# Altium schematic sheet IO_Combo_Keyboard_Mouse.SchDoc: Keyboard Mouse
size Tabloid; Date: 09/20/2024; Engineer: Terry D. Schevker; Revision: 1.0; SheetNumber: 1; SheetTotal: 5
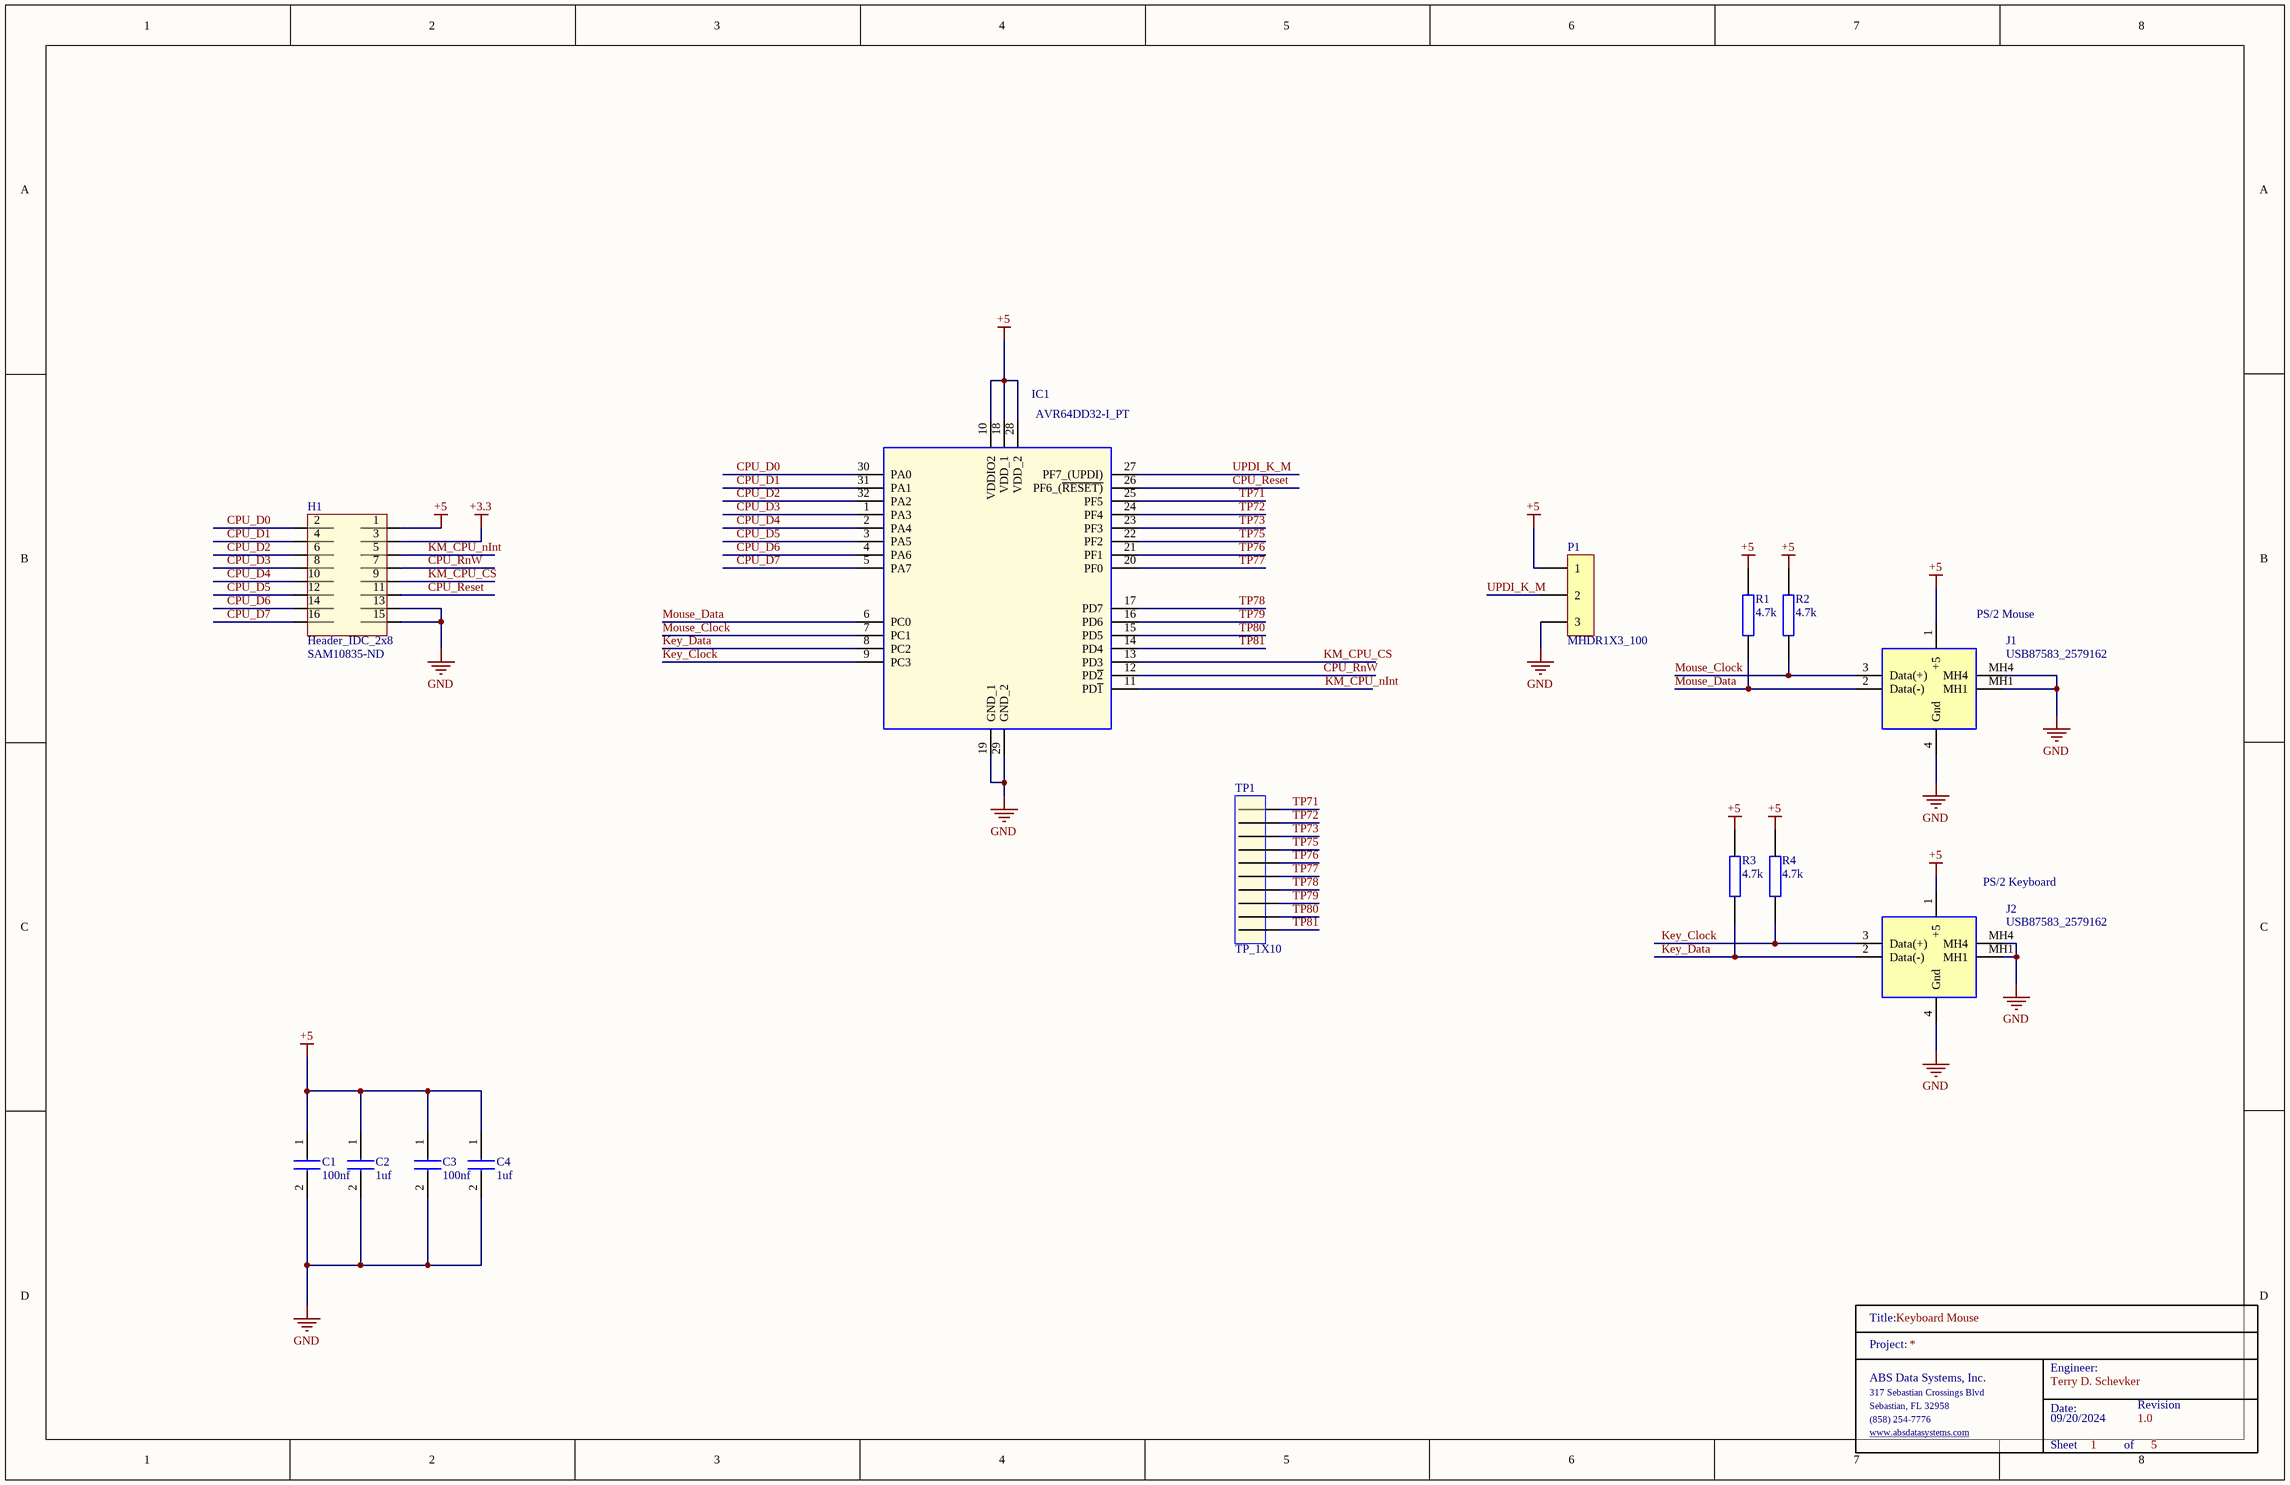
[diagram p0: IO_Combo_Keyboard_Mouse.SchDoc]

## Parts
C1  100nf  [0603]
C2  1uf  [0603]
C3  100nf  [0603]
C4  1uf  [0603]
H1  Header_IDC_2x8  Supplier Part Number 1: SAM10835-ND  [HEADER16]
IC1  AVR64DD32-I_PT  [QFP80P900X900X120-32N]
J1  USB87583_2579162  [87583-2579162]
J2  USB87583_2579162  [87583-2579162]
P1  MHDR1X3_100  [MHDR1X3_100]
R1  4.7k  [0603]
R2  4.7k  [0603]
R3  4.7k  [0603]
R4  4.7k  [0603]
TitleBlock_1  TitleBlock  (value not drawn)  (graphical)
TP1  TP_1X10  [TP_1X10]

## Nets
+3.3: H1.3
+5: C1.1 C2.1 C3.1 C4.1 H1.1 IC1.10(VDDIO2) IC1.18(VDD_1) IC1.28(VDD_2) J1.1(+5) J2.1(+5) P1.1 R1.1 R2.1 R3.1 R4.1
GND: C1.2 C2.2 C3.2 C4.2 H1.13 H1.15 IC1.19(GND_1) IC1.29(GND_2) J1.4(Gnd) J1.MH1 J1.MH4 J2.4(Gnd) J2.MH1 J2.MH4 P1.3
CPU_D0: H1.2 IC1.30(PA0)
CPU_D1: H1.4 IC1.31(PA1)
CPU_D2: H1.6 IC1.32(PA2)
CPU_D3: H1.8 IC1.1(PA3)
CPU_D4: H1.10 IC1.2(PA4)
CPU_D5: H1.12 IC1.3(PA5)
CPU_D6: H1.14 IC1.4(PA6)
CPU_D7: H1.16 IC1.5(PA7)
CPU_Reset: H1.11 IC1.26(PF6_(~{RESET)})
CPU_RnW: H1.7 IC1.12(PD~{2})
Key_Clock: IC1.9(PC3) J2.3(Data(+)) R4.2
Key_Data: IC1.8(PC2) J2.2(Data(-)) R3.2
KM_CPU_CS: H1.9 IC1.13(PD3)
KM_CPU_nInt: H1.5 IC1.11(PD~{1})
Mouse_Clock: IC1.7(PC1) J1.3(Data(+)) R2.2
Mouse_Data: IC1.6(PC0) J1.2(Data(-)) R1.2
TP71: IC1.25(PF5) TP1.1
TP72: IC1.24(PF4) TP1.2
TP73: IC1.23(PF3) TP1.3
TP75: IC1.22(PF2) TP1.4
TP76: IC1.21(PF1) TP1.5
TP77: IC1.20(PF0) TP1.6
TP78: IC1.17(PD7) TP1.7
TP79: IC1.16(PD6) TP1.8
TP80: IC1.15(PD5) TP1.9
TP81: IC1.14(PD4) TP1.10
UPDI_K_M: IC1.27(PF7_(UPDI)) P1.2

## Notes on the sheet
- (near J1) PS/2 Mouse
- (near J2) PS/2 Keyboard
- (in symbol TitleBlock) Title:; Project:; Engineer:; ABS Data Systems, Inc.; 317 Sebastian Crossings Blvd; Sebastian, FL 32958; Date:; Revision; (858) 254-7776; www.absdatasystems.com; Sheet; of

## Library data of the parts
C1 C3 = CL10B104JB8NNNC: Samsung Electro-Mechanics 0603 100nf
C2 C4 = CL10B105KA8NNNL: Samsung Electro-Mechanics 0603 1uf
H1 = Header_IDC_2x8: 16 Pin 2x8 Through Hold IDC Connector; Manufacturer: Samtec; Manufacturer Part Number: TST-108-01-G-D; Number of Contacts: 16; Gender: Male; Connector Type: Male Pin; Pitch: 2.54mm; Row Spacing: 0.1inch; Supplier 1: Digi-Key; RoHS: Yes; Category: Headers and Wire Housings; Stock 1: 227; Pricing 1: 1=2.85000, 10=2.73600, 100=2.28000, 500=1.93800, 1000=1.65300, 5000=1.48200 (USD); Mount: Through Hole; Contact Plating: Gold; Contact Material: Bronze; Housing Material: Polyester; Housing Color: Black; Color: Black; Min Operating Temperature: -55°C; Max Operating Temperature: 125°C; Number of Rows: 2; Termination: Solder; Packaging: Rail/Tube; Orientation: Straight; Number of Positions: 16; Length: 27.94mm; Depth: 9.27mm; Contact Mating Length: 0.25inch; REACH SVHC: No SVHC; ComponentLink1URL: https://datasheet.ciiva.com/739/tst-mkt-739845.pdf?src-supplier=Digi-Key; ComponentLink1Description: https://datasheet.ciiva.com/739/tst-mkt-739845.pdf?src-supplier=Digi-Key; ComponentLink2URL: https://datasheet.ciiva.com/10018/htst-10018510.pdf?src-supplier=Avnet; ComponentLink2Description: https://datasheet.ciiva.com/10018/htst-10018510.pdf?src-supplier=Avnet
IC1 = AVR64DD32-I_PT: Integrated Circuit; Manufacturer_Name: Microchip; Manufacturer_Part_Number: AVR64DD32-I/PT | MULTI-VOLTAGE I/O; Datasheet Link: https://www.microchip.com/en-us/product/AVR64DD32; Height: 1.2mm
J1 J2 = USB87583_2579162: USB Connectors USB A Plug, SMT, R/A, GF, With Kinked shell stakes and posts, T&R; Manufacturer_Name: GCT (GLOBAL CONNECTOR TECHNOLOGY); Manufacturer_Part_Number: USB1061-GF-L-A; Geometry.Height: 4.6mm; Mouser Part Number: 640-USB1061-GF-L-A; Mouser Price/Stock: https://www.mouser.co.uk/ProductDetail/GCT/USB1061-GF-L-A?qs=KUoIvG%2F9IlYSthVIrIBVzQ%3D%3D; Datasheet Link: https://gct.co/connector/usb1061
P1 = MHDR1X3_100: Header, 3-Pin; LatestRevisionDate: 17-Jul-2002; LatestRevisionNote: Re-released for DXP Platform.; Publisher: Altium Limited
R1-R4 = RC0603FR-104K7L: YAGEO 0603 4.7k; Manufacturer_Name: KEMET; Manufacturer_Part_Number: RC0603JR-070RL; Geometry.Height: 0.55mm; Mouser Part Number: 603-RC0603JR-070RL; Mouser Price/Stock: https://www.mouser.co.uk/ProductDetail/YAGEO/RC0603JR-070RL?qs=2cAdsCoAWRGWyPcuXgGiXQ%3D%3D; Datasheet Link: https://datasheet.datasheetarchive.com/originals/distributors/Datasheets_SAMA/902f9e387b938f871d31120f5fc1d65e.pdf
TP1 = TP_1X10: Manufacturer: Samtec; Manufacturer Part Number: TST-105-01-G-D; Number of Contacts: 16; Gender: Male; Connector Type: Male Pin; Pitch: 2.54mm; Row Spacing: 0.1inch; Supplier 1: Digi-Key; RoHS: Yes; Category: Headers and Wire Housings; Stock 1: 227; Pricing 1: 1=2.85000, 10=2.73600, 100=2.28000, 500=1.93800, 1000=1.65300, 5000=1.48200 (USD); Mount: Through Hole; Contact Plating: Gold; Contact Material: Bronze; Housing Material: Polyester; Housing Color: Black; Color: Black; Min Operating Temperature: -55°C; Max Operating Temperature: 125°C; Number of Rows: 2; Termination: Solder; Packaging: Rail/Tube; Orientation: Straight; Number of Positions: 16; Length: 27.94mm; Depth: 9.27mm; Contact Mating Length: 0.25inch; REACH SVHC: No SVHC; ComponentLink1URL: https://datasheet.ciiva.com/739/tst-mkt-739845.pdf?src-supplier=Digi-Key; ComponentLink1Description: https://datasheet.ciiva.com/739/tst-mkt-739845.pdf?src-supplier=Digi-Key; ComponentLink2URL: https://datasheet.ciiva.com/10018/htst-10018510.pdf?src-supplier=Avnet; ComponentLink2Description: https://datasheet.ciiva.com/10018/htst-10018510.pdf?src-supplier=Avnet